# EAGLE design plc-6u-rs485-router (EAGLE 6.2)
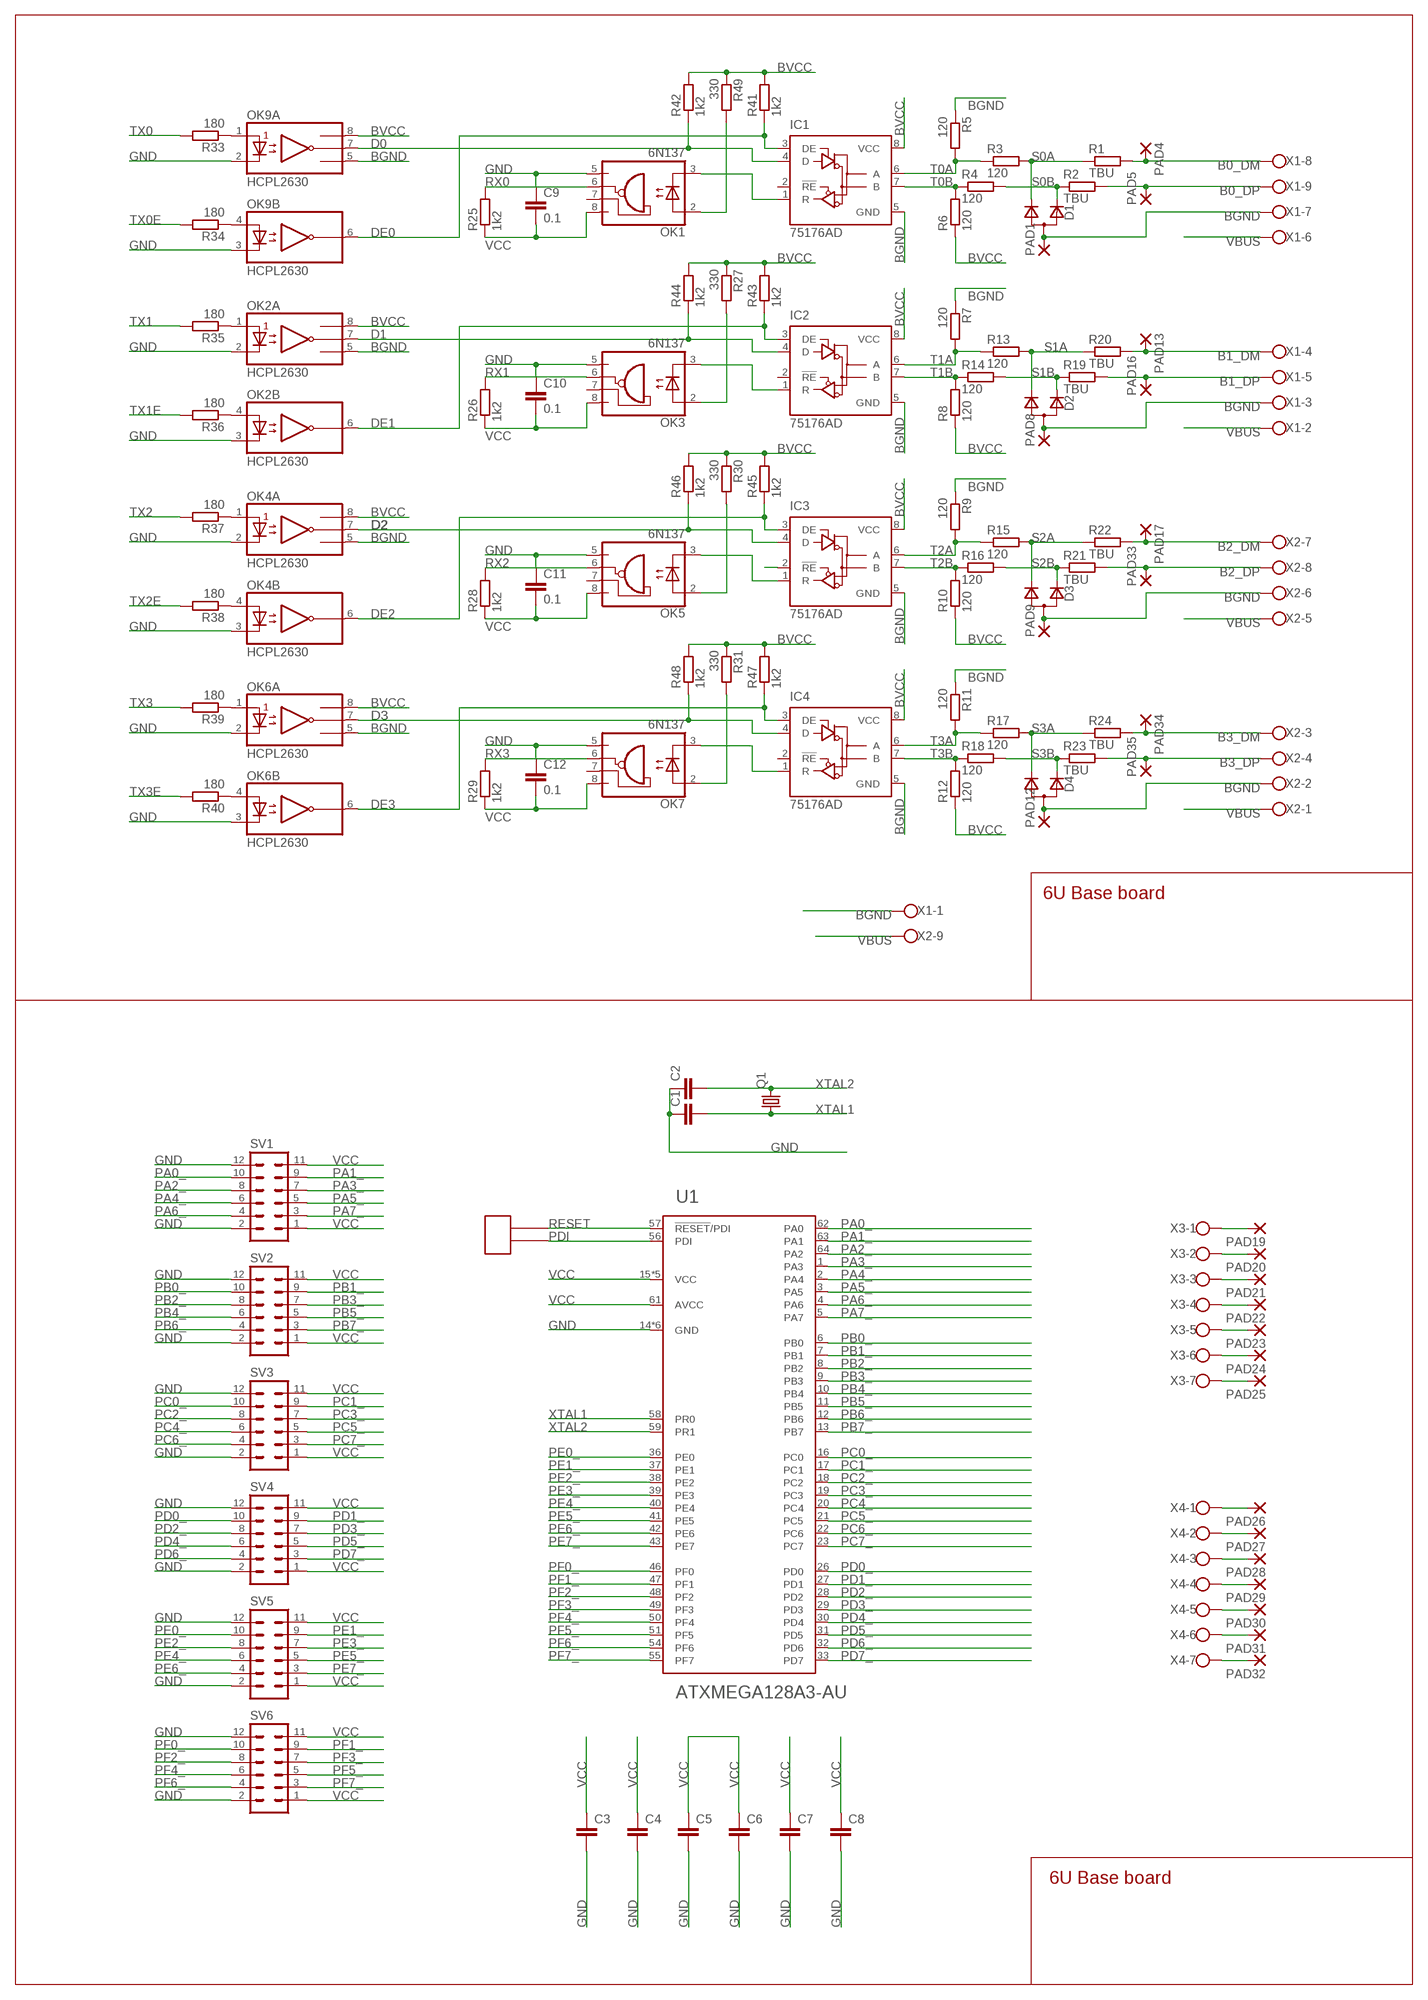
[diagram p0: schematic, sheet 1]

## Parts
C1  C-EUC0805  [C0805]
C2  C-EUC0805  [C0805]
C3  C-EUC0603  [C0603]
C4  C-EUC0603  [C0603]
C5  C-EUC0603  [C0603]
C6  C-EUC0603  [C0603]
C7  C-EUC0603  [C0603]
C8  C-EUC0603  [C0603]
C9  0.1  C-EUC0805  [C0805]
C10  0.1  C-EUC0805  [C0805]
C11  0.1  C-EUC0805  [C0805]
C12  0.1  C-EUC0805  [C0805]
D1  D_2CSOT323  [SOT323]
D2  D_2CSOT323  [SOT323]
D3  D_2CSOT323  [SOT323]
D4  D_2CSOT323  [SOT323]
IC1  75176AD  [D_R-PDSO-G8]
IC2  75176AD  [D_R-PDSO-G8]
IC3  75176AD  [D_R-PDSO-G8]
IC4  75176AD  [D_R-PDSO-G8]
OK1  6N137  [DIL08]
OK2  HCPL2630  [DIL08]
OK3  6N137  [DIL08]
OK4  HCPL2630  [DIL08]
OK5  6N137  [DIL08]
OK6  HCPL2630  [DIL08]
OK7  6N137  [DIL08]
OK9  HCPL2630  [DIL08]
PAD1  2,54/0,8  [2,54/0,8]
PAD4  2,54/0,8  [2,54/0,8]
PAD5  2,54/0,8  [2,54/0,8]
PAD8  2,54/0,8  [2,54/0,8]
PAD9  2,54/0,8  [2,54/0,8]
PAD12  2,54/0,8  [2,54/0,8]
PAD13  2,54/0,8  [2,54/0,8]
PAD16  2,54/0,8  [2,54/0,8]
PAD17  2,54/0,8  [2,54/0,8]
PAD19  2,54/0,8  [2,54/0,8]
PAD20  2,54/0,8  [2,54/0,8]
PAD21  2,54/0,8  [2,54/0,8]
PAD22  2,54/0,8  [2,54/0,8]
PAD23  2,54/0,8  [2,54/0,8]
PAD24  2,54/0,8  [2,54/0,8]
PAD25  2,54/0,8  [2,54/0,8]
PAD26  2,54/0,8  [2,54/0,8]
PAD27  2,54/0,8  [2,54/0,8]
PAD28  2,54/0,8  [2,54/0,8]
PAD29  2,54/0,8  [2,54/0,8]
PAD30  2,54/0,8  [2,54/0,8]
PAD31  2,54/0,8  [2,54/0,8]
PAD32  2,54/0,8  [2,54/0,8]
PAD33  2,54/0,8  [2,54/0,8]
PAD34  2,54/0,8  [2,54/0,8]
PAD35  2,54/0,8  [2,54/0,8]
Q1  CRYSTALHC49S  [HC49/S]
R1  TBU  R-EU_WSC2515  [WSC2515]
R2  TBU  R-EU_WSC2515  [WSC2515]
R3  120  R-EU_R0805  [R0805]
R4  120  R-EU_R0805  [R0805]
R5  120  R-EU_R0805  [R0805]
R6  120  R-EU_R0805  [R0805]
R7  120  R-EU_R0805  [R0805]
R8  120  R-EU_R0805  [R0805]
R9  120  R-EU_R0805  [R0805]
R10  120  R-EU_R0805  [R0805]
R11  120  R-EU_R0805  [R0805]
R12  120  R-EU_R0805  [R0805]
R13  120  R-EU_R0805  [R0805]
R14  120  R-EU_R0805  [R0805]
R15  120  R-EU_R0805  [R0805]
R16  120  R-EU_R0805  [R0805]
R17  120  R-EU_R0805  [R0805]
R18  120  R-EU_R0805  [R0805]
R19  TBU  R-EU_WSC2515  [WSC2515]
R20  TBU  R-EU_WSC2515  [WSC2515]
R21  TBU  R-EU_WSC2515  [WSC2515]
R22  TBU  R-EU_WSC2515  [WSC2515]
R23  TBU  R-EU_WSC2515  [WSC2515]
R24  TBU  R-EU_WSC2515  [WSC2515]
R25  1k2  R-EU_R0805  [R0805]
R26  1k2  R-EU_R0805  [R0805]
R27  330  R-EU_R0805  [R0805]
R28  1k2  R-EU_R0805  [R0805]
R29  1k2  R-EU_R0805  [R0805]
R30  330  R-EU_R0805  [R0805]
R31  330  R-EU_R0805  [R0805]
R33  180  R-EU_R0805  [R0805]
R34  180  R-EU_R0805  [R0805]
R35  180  R-EU_R0805  [R0805]
R36  180  R-EU_R0805  [R0805]
R37  180  R-EU_R0805  [R0805]
R38  180  R-EU_R0805  [R0805]
R39  180  R-EU_R0805  [R0805]
R40  180  R-EU_R0805  [R0805]
R41  1k2  R-EU_R0805  [R0805]
R42  1k2  R-EU_R0805  [R0805]
R43  1k2  R-EU_R0805  [R0805]
R44  1k2  R-EU_R0805  [R0805]
R45  1k2  R-EU_R0805  [R0805]
R46  1k2  R-EU_R0805  [R0805]
R47  1k2  R-EU_R0805  [R0805]
R48  1k2  R-EU_R0805  [R0805]
R49  330  R-EU_R0805  [R0805]
SV1  MA06-2  [MA06-2]
SV2  MA06-2  [MA06-2]
SV3  MA06-2  [MA06-2]
SV4  MA06-2  [MA06-2]
SV5  MA06-2  [MA06-2]
SV6  MA06-2  [MA06-2]
U1  ATXMEGA128A3-AU  [TQFP-64A-64]
U$1  MA02-1  [MA02-1]
X1  W237-09P  [W237-9P]
X2  W237-09P  [W237-9P]
X3  W237-07P  [W237-7P]
X4  W237-07P  [W237-7P]

## Nets
B0_DM: PAD4.1(P) R1.2 X1.8
B0_DP: PAD5.1(P) R2.2 X1.9
B1_DM: PAD16.1(P) R19.2 X1.5
B1_DP: PAD13.1(P) R20.2 X1.4
B2_DM: PAD17.1(P) R22.2 X2.7
B2_DP: PAD33.1(P) R21.2 X2.8
B3_DM: PAD34.1(P) R24.2 X2.3
B3_DP: PAD35.1(P) R23.2 X2.4
BGND: D1.1(A) D2.1(A) D3.1(A) D4.1(A) IC1.5(GND) IC2.5(GND) IC3.5(GND) IC4.5(GND) OK2.5(A:GND) OK4.5(A:GND) OK6.5(A:GND) OK9.5(A:GND) PAD1.1(P) PAD8.1(P) PAD9.1(P) PAD12.1(P) R5.1 R7.1 R9.1 R11.1 X1.1 X1.3 X1.7 X2.2 X2.6
BVCC: IC1.8(VCC) IC2.8(VCC) IC3.8(VCC) IC4.8(VCC) OK2.8(A:VCC) OK4.8(A:VCC) OK6.8(A:VCC) OK9.8(A:VCC) R6.1 R8.1 R10.1 R12.1 R27.1 R30.1 R31.1 R41.2 R42.2 R43.2 R44.2 R45.2 R46.2 R47.2 R48.2 R49.1
D0: IC1.4(D) OK9.7(A:VO1) R42.1
D1: IC2.4(D) OK2.7(A:VO1) R44.1
D2: IC3.4(D) OK4.7(A:VO1) R46.1
D3: IC4.4(D) OK6.7(A:VO1) R48.1
DE0: IC1.3(DE) OK9.6(B:VO2) R41.1
DE1: IC2.3(DE) OK2.6(B:VO2) R43.1
DE2: IC3.3(DE) OK4.6(B:VO2) R45.1
DE3: IC4.3(DE) OK6.6(B:VO2) R47.1
GND: C1.1 C2.1 C3.2 C4.2 C5.2 C6.2 C7.2 C8.2 C9.1 C10.1 C11.1 C12.1 OK1.5(GND) OK2.2(A:C1) OK2.3(B:C2) OK3.5(GND) OK4.2(A:C1) OK4.3(B:C2) OK5.5(GND) OK6.2(A:C1) OK6.3(B:C2) OK7.5(GND) OK9.2(A:C1) OK9.3(B:C2) SV1.2 SV1.12 SV2.2 SV2.12 SV3.2 SV3.12 SV4.2 SV4.12 SV5.2 SV5.12 SV6.2 SV6.12 U1.14(GND) U1.24(GND) U1.34(GND) U1.44(GND) U1.52(GND) U1.60(GND)
N$1: OK7.2(A) R31.2
N$2: OK5.2(A) R30.2
N$3: OK3.2(A) R27.2
N$4: OK1.2(A) R49.2
N$5: OK2.1(A:A1) R35.1
N$6: OK2.4(B:A2) R36.1
N$7: OK4.1(A:A1) R37.1
N$8: OK9.1(A:A1) R33.1
N$9: OK4.4(B:A2) R38.1
N$10: OK6.1(A:A1) R39.1
N$11: OK9.4(B:A2) R34.1
N$12: OK6.4(B:A2) R40.1
N$21: PAD19.1(P) X3.1
N$22: PAD20.1(P) X3.2
N$23: PAD21.1(P) X3.3
N$24: PAD22.1(P) X3.4
N$25: PAD23.1(P) X3.5
N$26: PAD24.1(P) X3.6
N$27: PAD25.1(P) X3.7
N$28: PAD26.1(P) X4.1
N$29: PAD27.1(P) X4.2
N$30: PAD28.1(P) X4.3
N$31: PAD29.1(P) X4.4
N$32: PAD30.1(P) X4.5
N$33: PAD31.1(P) X4.6
N$34: PAD32.1(P) X4.7
N$41: IC3.2(!RE)
PA0_: SV1.10 U1.62(PA0)
PA1_: SV1.9 U1.63(PA1)
PA2_: SV1.8 U1.64(PA2)
PA3_: SV1.7 U1.1(PA3)
PA4_: SV1.6 U1.2(PA4)
PA5_: SV1.5 U1.3(PA5)
PA6_: SV1.4 U1.4(PA6)
PA7_: SV1.3 U1.5(PA7)
PB0_: SV2.10 U1.6(PB0)
PB1_: SV2.9 U1.7(PB1)
PB2_: SV2.8 U1.8(PB2)
PB3_: SV2.7 U1.9(PB3)
PB4_: SV2.6 U1.10(PB4)
PB5_: SV2.5 U1.11(PB5)
PB6_: SV2.4 U1.12(PB6)
PB7_: SV2.3 U1.13(PB7)
PC0_: SV3.10 U1.16(PC0)
PC1_: SV3.9 U1.17(PC1)
PC2_: SV3.8 U1.18(PC2)
PC3_: SV3.7 U1.19(PC3)
PC4_: SV3.6 U1.20(PC4)
PC5_: SV3.5 U1.21(PC5)
PC6_: SV3.4 U1.22(PC6)
PC7_: SV3.3 U1.23(PC7)
PD0_: SV4.10 U1.26(PD0)
PD1_: SV4.9 U1.27(PD1)
PD2_: SV4.8 U1.28(PD2)
PD3_: SV4.7 U1.29(PD3)
PD4_: SV4.6 U1.30(PD4)
PD5_: SV4.5 U1.31(PD5)
PD6_: SV4.4 U1.32(PD6)
PD7_: SV4.3 U1.33(PD7)
PDI: U1.56(PDI) U$1.P1
PE0_: SV5.10 U1.36(PE0)
PE1_: SV5.9 U1.37(PE1)
PE2_: SV5.8 U1.38(PE2)
PE3_: SV5.7 U1.39(PE3)
PE4_: SV5.6 U1.40(PE4)
PE5_: SV5.5 U1.41(PE5)
PE6_: SV5.4 U1.42(PE6)
PE7_: SV5.3 U1.43(PE7)
PF0_: SV6.10 U1.46(PF0)
PF1_: SV6.9 U1.47(PF1)
PF2_: SV6.8 U1.48(PF2)
PF3_: SV6.7 U1.49(PF3)
PF4_: SV6.6 U1.50(PF4)
PF5_: SV6.5 U1.51(PF5)
PF6_: SV6.4 U1.54(PF6)
PF7_: SV6.3 U1.55(PF7)
R0: IC1.1(R) OK1.3(C)
R1: IC2.1(R) OK3.3(C)
R2: IC3.1(R) OK5.3(C)
R3: IC4.1(R) OK7.3(C)
RESET: U1.57(!RESET!/PDI) U$1.P2
RX0: OK1.6(VO) R25.2
RX1: OK3.6(VO) R26.2
RX2: OK5.6(VO) R28.2
RX3: OK7.6(VO) R29.2
S0A: D1.3(C2) R1.1 R3.2
S0B: D1.2(C1) R2.1 R4.2
S1A: D2.3(C2) R13.2 R20.1
S1B: D2.2(C1) R14.2 R19.1
S2A: D3.3(C2) R15.2 R22.1
S2B: D3.2(C1) R16.2 R21.1
S3A: D4.3(C2) R17.2 R24.1
S3B: D4.2(C1) R18.2 R23.1
T0A: IC1.6(A) R3.1 R5.2
T0B: IC1.7(B) R4.1 R6.2
T1A: IC2.6(A) R7.2 R13.1
T1B: IC2.7(B) R8.2 R14.1
T2A: IC3.6(A) R9.2 R15.1
T2B: IC3.7(B) R10.2 R16.1
T3A: IC4.6(A) R11.2 R17.1
T3B: IC4.7(B) R12.2 R18.1
TX0: R33.2
TX0E: R34.2
TX1: R35.2
TX1E: R36.2
TX2: R37.2
TX2E: R38.2
TX3: R39.2
TX3E: R40.2
VBUS: X1.2 X1.6 X2.1 X2.5 X2.9
VCC: C3.1 C4.1 C5.1 C6.1 C7.1 C8.1 C9.2 C10.2 C11.2 C12.2 OK1.8(VCC) OK3.8(VCC) OK5.8(VCC) OK7.8(VCC) R25.1 R26.1 R28.1 R29.1 SV1.1 SV1.11 SV2.1 SV2.11 SV3.1 SV3.11 SV4.1 SV4.11 SV5.1 SV5.11 SV6.1 SV6.11 U1.15(VCC) U1.25(VCC) U1.35(VCC) U1.45(VCC) U1.53(VCC) U1.61(AVCC)
XTAL1: C1.2 Q1.1 U1.58(PR0)
XTAL2: C2.2 Q1.2 U1.59(PR1)
Unconnected: IC1.2(!RE) IC2.2(!RE) IC4.2(!RE) OK1.7(VE) OK3.7(VE) OK5.7(VE) OK7.7(VE)

## Notes on the sheet
- 6U Base board
- 6U Base board

## Library data of the parts
C1-C12 = rcl:C-EU: CAPACITOR, European symbol
D1-D4 = zetex:D_2C: Dual DIODE; OC_FARNELL: unknown; OC_NEWARK: unknown
IC1-IC4 = 751xx:75176A: DIFFERENTIAL BUS TRANSCEIVER Source: http://focus.ti.com/lit/ds/symlink/sn75176a.pdf
OK1 OK3 OK5 OK7 = optocoupler:6N137: MOTOROLA OPTO COUPLER; MPN: 6N137; OC_FARNELL: 1328376; OC_NEWARK: 52M1895
OK2 OK4 OK6 OK9 = optocoupler:HCPL2630: HEWLETT PACKARD OPTO COUPLER; MF: AGILENT TECHNOLOGIES; MPN: HCPL-2630-000E; OC_FARNELL: 9994904; OC_NEWARK: 88H7813
PAD1 PAD4 PAD5 PAD8 PAD9 PAD12 PAD13 PAD16 PAD17 PAD19-PAD35 = wirepad:2,54/0,8: THROUGH-HOLE PAD
Q1 = crystal:CRYSTAL: CRYSTAL
R1-R31 R33-R49 = rcl:R-EU_: RESISTOR, European symbol
SV1-SV6 = con-lstb:MA06-2: PIN HEADER; OC_FARNELL: unknown; OC_NEWARK: unknown
U1 = atmel-xmega:ATXMEGA128A3: 8/16-bit XMEGA A3 Microcontroller Features High-performance, Low-power 8/16-bit Atmel® AVR® XMEGATM Microcontroller Non-volatile Program and Data Memories – 64 KB - 256 KB of In-System Self-Programmable Flash – 4 KB - 8 KB Boot Code Section with Independent Lock Bits – 2 KB - 4 KB EEPROM – 4 KB - 16 KB Internal SRAM Peripheral Features – Four-channel DMA Controller with support for external requests – Eight-channel Event System – Seven 16-bit Timer/Counters Four Timer/Counters with 4 Output Compare or Input Capture channels Three Timer/Counters with 2 Output Compare or Input Capture channels High Resolution Extensions on all Timer/Counters Advanced Waveform Extension on one Timer/Counter – Seven USARTs IrDA Extension on 1 USART – AES and DES Crypto Engine – Two Two-wire Interfaces with dual address match (I2C and SMBus compatible) – Three SPI (Serial Peripheral Interfaces) – 16-bit Real Time Counter with Separate Oscillator – Two Eight-channel, 12-bit, 2 Msps Analog to Digital Converters – One Two-channel, 12-bit, 1 Msps Digital to Analog Converter – Four Analog Comparators with Window compare function – External Interrupts on all General Purpose I/O pins – Programmable Watchdog Timer with Separate On-chip Ultra Low Power Oscillator Special Microcontroller Features – Power-on Reset and Programmable Brown-out Detection – Internal and External Clock Options with PLL – Programmable Multi-level Interrupt Controller – Sleep Modes: Idle, Power-down, Standby, Power-save, Extended Standby – Advanced Programming, Test and Debugging Interfaces JTAG (IEEE 1149.1 Compliant) Interface for test, debug and programming PDI (Program and Debug Interface) for programming, test and debugging I/O and Packages – 50 Programmable I/O Lines – 64-lead TQFP – 64-pad QFN Operating Voltage – 1.6 – 3.6V Speed performance – 0 – 12 MHz @ 1.6 – 3.6V – 0 – 32 MHz @ 2.7 – 3.6V
U$1 = my-con:MA02-1
X1 X2 = con-wago-508:W237-09P: WAGO SREW CLAMP
X3 X4 = con-wago-508:W237-07P: WAGO SREW CLAMP

## Board
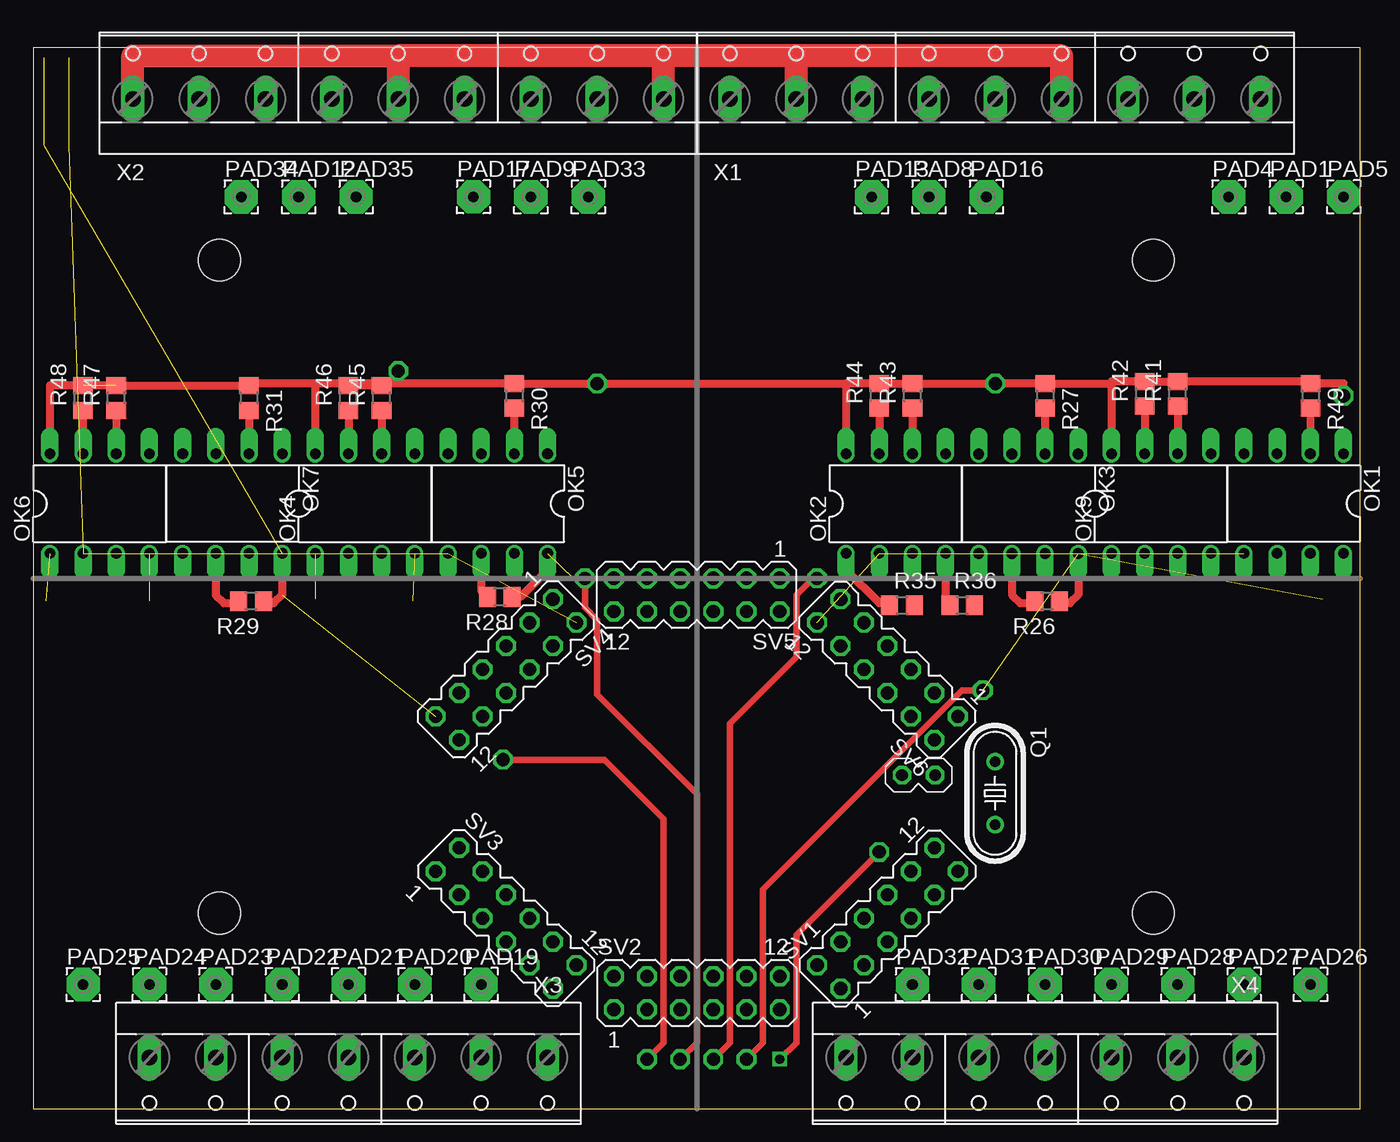
[diagram p1: board, top side]
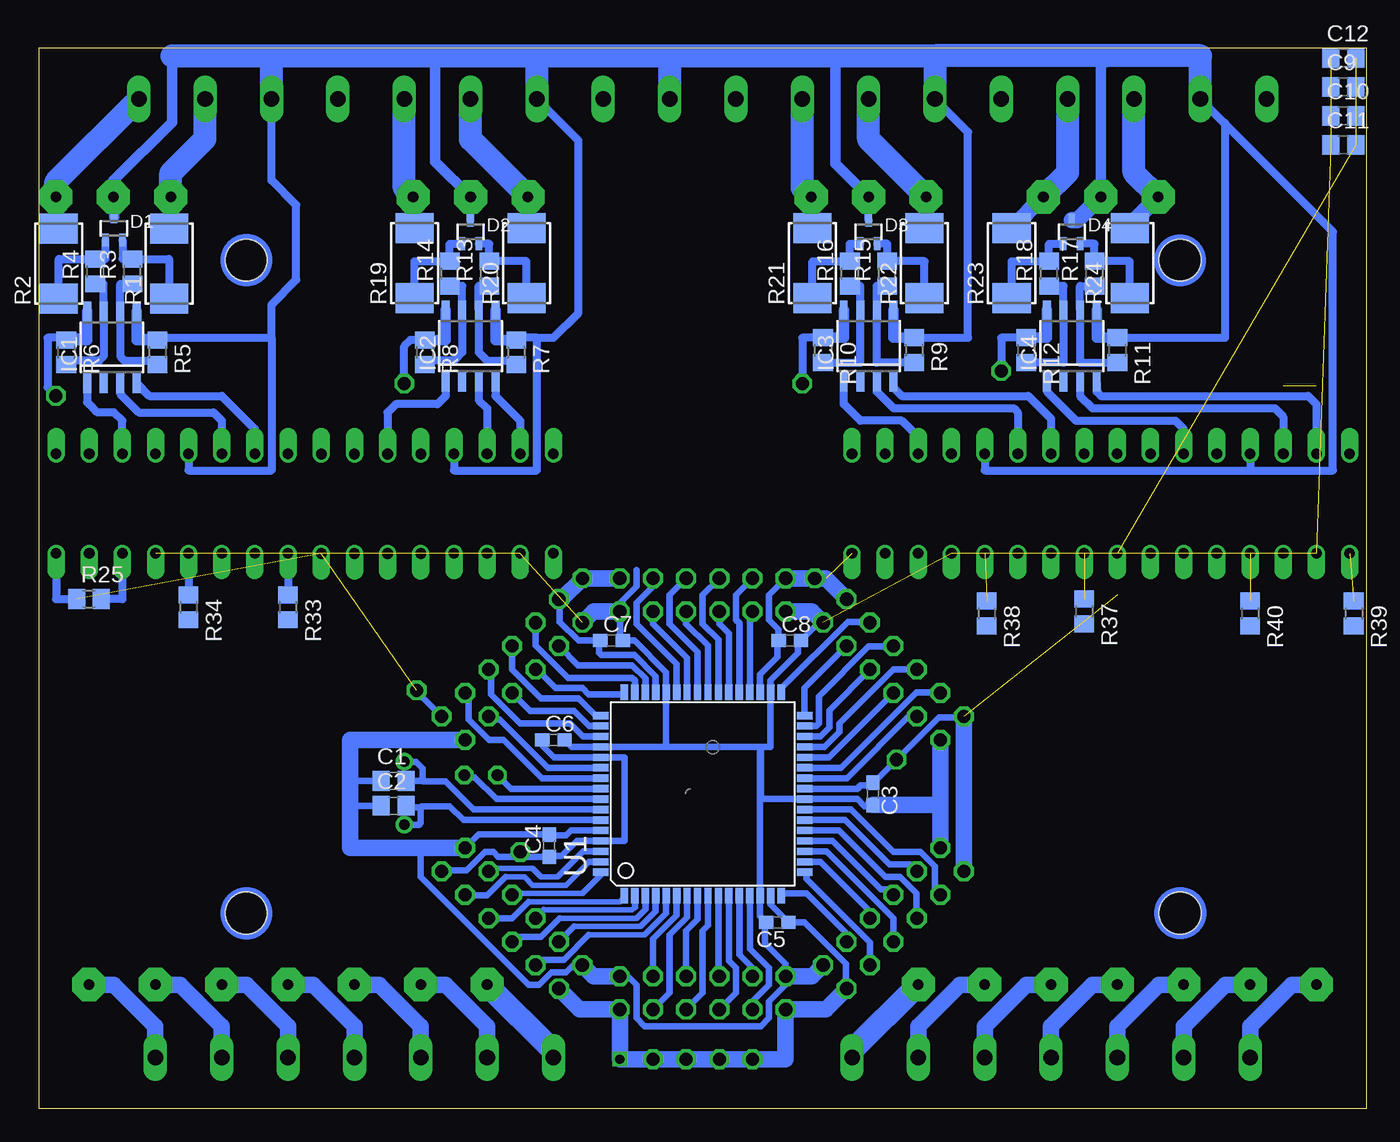
[diagram p2: board, bottom side, seen from below]

Size 101.6 x 81.28 mm. Coordinates in mm from the lower left corner, seen from the top.
Outline: 0,0.01 101.6,0 101.6,81.28 0,81.28 0,0.01
Copper layers (1*16): Top 0.035mm / dielectric 1.5mm / Bottom 0.035mm
Design rules: minimum track width 10mil, minimum drill 24mil, track to track 8mil, track to pad 8mil, pad to pad 8mil, via to via 8mil, smd to smd 8mil, copper to edge 40mil, drill to drill 8mil, minimum pad ring 10mil, minimum via ring 8mil, stop-mask expansion 4mil, vias tented up to drill 0mil, thermal gap 10mil
Holes 3.2 mm at 14.25,15 14.25,65 85.75,15 85.75,65
bRestrict: area 10.5,11.1 to 18.1,18.7; area 81.9,11.3 to 89.5,18.9; area 10.4,61.2 to 18,68.8; area 81.9,61.2 to 89.5,68.8

### Footprints (pad centres in the part's own frame; a part is rotated, then mirrored left to right if it is on the bottom)
C0805 = smd 1.3 x 1.5: 1 -0.95,0; 2 0.95,0
C0603 = smd 1.1 x 1: 1 -0.85,0; 2 0.85,0
SOT323 = smd 0.5 x 1: 1 0,0.9; 2 -0.65,-0.9; 3 0.65,-0.9
D_R-PDSO-G8 = smd 0.6 x 1.5: 1 -1.905,-2.75; 2 -0.635,-2.75; 3 0.635,-2.75; 4 1.905,-2.75; 5 1.905,2.75; 6 0.635,2.75; 7 -0.635,2.75; 8 -1.905,2.75
DIL08 = drill 0.813 offset: 1 -3.81,-3.81; 2 -1.27,-3.81; 3 1.27,-3.81; 4 3.81,-3.81; 5 3.81,3.81; 6 1.27,3.81; 7 -1.27,3.81; 8 -3.81,3.81
2,54/0,8 = drill 0.813 pad 2.54 octagon: 1 0,0
HC49/S = drill 0.813: 1 -2.413,0; 2 2.413,0
WSC2515 = smd 2.29 x 2.92: 1 -2.675,0; 2 2.675,0
R0805 = smd 1.3 x 1.5: 1 -0.95,0; 2 0.95,0
MA06-2 = drill 1.016 octagon: 1 -6.35,-1.27; 2 -6.35,1.27; 3 -3.81,-1.27; 4 -3.81,1.27; 5 -1.27,-1.27; 6 -1.27,1.27; 7 1.27,-1.27; 8 1.27,1.27; 9 3.81,-1.27; 10 3.81,1.27; 11 6.35,-1.27; 12 6.35,1.27
TQFP-64A-64 = smd 1.194 x 0.559: 1 -7.8,6; 2 -7.8,5.2; 3 -7.8,4.4; 4 -7.8,3.6; 5 -7.8,2.8; 6 -7.8,2; 7 -7.8,1.2; 8 -7.8,0.4; 9 -7.8,-0.4; 10 -7.8,-1.2; 11 -7.8,-2; 12 -7.8,-2.8; 13 -7.8,-3.6; 14 -7.8,-4.4; 15 -7.8,-5.2; 16 -7.8,-6; 33 7.8,-6; 34 7.8,-5.2; 35 7.8,-4.4; 36 7.8,-3.6; 37 7.8,-2.8; 38 7.8,-2; 39 7.8,-1.2; 40 7.8,-0.4; 41 7.8,0.4; 42 7.8,1.2; 43 7.8,2; 44 7.8,2.8; 45 7.8,3.6; 46 7.8,4.4; 47 7.8,5.2; 48 7.8,6 | smd 0.559 x 1.194: 17 -6,-7.8; 18 -5.2,-7.8; 19 -4.4,-7.8; 20 -3.6,-7.8; 21 -2.8,-7.8; 22 -2,-7.8; 23 -1.2,-7.8; 24 -0.4,-7.8; 25 0.4,-7.8; 26 1.2,-7.8; 27 2,-7.8; 28 2.8,-7.8; 29 3.6,-7.8; 30 4.4,-7.8; 31 5.2,-7.8; 32 6,-7.8; 49 6,7.8; 50 5.2,7.8; 51 4.4,7.8; 52 3.6,7.8; 53 2.8,7.8; 54 2,7.8; 55 1.2,7.8; 56 0.4,7.8; 57 -0.4,7.8; 58 -1.2,7.8; 59 -2,7.8; 60 -2.8,7.8; 61 -3.6,7.8; 62 -4.4,7.8; 63 -5.2,7.8; 64 -6,7.8
MA02-1 = drill 0.9 octagon: P1 -1.27,0; P2 1.27,0
W237-9P = drill 1.194 long: 1 -20.32,-0.635; 2 -15.24,-0.635; 3 -10.16,-0.635; 4 -5.08,-0.635; 5 0,-0.635; 6 5.08,-0.635; 7 10.16,-0.635; 8 15.24,-0.635; 9 20.32,-0.635
W237-7P = drill 1.194 long: 1 -15.24,-0.635; 2 -10.16,-0.635; 3 -5.08,-0.635; 4 0,-0.635; 5 5.08,-0.635; 6 10.16,-0.635; 7 15.24,-0.635

### Placement (x,y rotation side)
C1  74.47,25.12 0 bottom
C2  74.47,23.22 0 bottom
C3  37.79,24.13 270 bottom
C4  62.55,20.16 90 bottom
C5  45.09,14.29 180 bottom
C6  62.23,28.26 0 bottom
C7  57.79,35.88 0 bottom
C8  44.14,35.88 0 bottom
C9  1.75,78.26 0 bottom
C10  1.75,76.04 0 bottom
C11  1.75,73.82 0 bottom
C12  1.75,80.49 0 bottom
D1  95.88,67.42 0 bottom
D2  68.58,67.15 0 bottom
D3  38.1,67.15 0 bottom
D4  22.55,67.15 0 bottom
IC1  96.04,58.33 0 bottom
IC2  68.58,58.42 0 bottom
IC3  38.1,58.42 0 bottom
IC4  22.55,58.42 0 bottom
OK1  96.51,46.36 180 top
OK2  66.04,46.35 0 top
OK3  76.2,46.35 180 top
OK4  25.4,46.35 0 top
OK5  35.57,46.35 180 top
OK6  5.08,46.35 0 top
OK7  15.25,46.36 180 top
OK9  86.36,46.35 0 top
PAD1  95.93,69.85 0 top
PAD4  91.53,69.85 0 top
PAD5  100.33,69.85 0 top
PAD8  68.58,69.85 0 top
PAD9  38.1,69.85 0 top
PAD12  20.32,69.85 0 top
PAD13  64.18,69.85 0 top
PAD16  72.98,69.85 0 top
PAD17  33.7,69.85 0 top
PAD19  34.29,9.53 0 top
PAD20  29.21,9.53 0 top
PAD21  24.13,9.53 0 top
PAD22  19.05,9.53 0 top
PAD23  13.97,9.53 0 top
PAD24  8.89,9.53 0 top
PAD25  3.81,9.53 0 top
PAD26  97.79,9.53 0 top
PAD27  92.71,9.53 0 top
PAD28  87.63,9.53 0 top
PAD29  82.55,9.53 0 top
PAD30  77.47,9.52 0 top
PAD31  72.39,9.53 0 top
PAD32  67.31,9.53 0 top
PAD33  42.5,69.85 0 top
PAD34  15.92,69.85 0 top
PAD35  24.72,69.85 0 top
Q1  73.64,24.18 270 top
R1  91.66,64.73 90 bottom
R2  100.11,64.74 90 bottom
R3  94.46,64.14 90 bottom
R4  97.32,64.14 90 bottom
R5  92.55,57.94 270 bottom
R6  99.54,57.94 270 bottom
R7  65.09,57.94 270 bottom
R8  72.08,57.94 270 bottom
R9  34.61,58.1 270 bottom
R10  41.6,58.1 270 bottom
R11  19.05,58.1 270 bottom
R12  26.04,58.1 270 bottom
R13  67.15,63.98 90 bottom
R14  70.17,63.98 90 bottom
R15  36.67,63.98 90 bottom
R16  39.53,63.98 90 bottom
R17  20.8,63.98 90 bottom
R18  24.29,63.98 90 bottom
R19  72.87,64.77 90 bottom
R20  64.3,64.77 90 bottom
R21  42.39,64.77 90 bottom
R22  33.82,64.77 90 bottom
R23  27.15,64.77 90 bottom
R24  18.1,64.77 90 bottom
R25  97.79,39.05 0 bottom
R26  77.63,38.89 180 top
R27  77.47,54.61 270 top
R28  35.72,39.21 180 top
R29  16.67,38.89 180 top
R30  36.83,54.61 270 top
R31  16.51,54.45 270 top
R33  82.55,38.42 270 bottom
R34  90.17,38.42 270 bottom
R35  66.52,38.58 0 top
R36  71.12,38.58 0 top
R37  21.59,38.1 270 bottom
R38  29.05,37.94 270 bottom
R39  0.96,37.94 270 bottom
R40  8.89,37.94 270 bottom
R41  87.63,54.77 90 top
R42  85.09,54.77 90 top
R43  67.31,54.61 90 top
R44  64.77,54.61 90 top
R45  26.67,54.45 90 top
R46  24.13,54.45 90 top
R47  6.35,54.45 90 top
R48  3.81,54.45 90 top
R49  97.79,54.61 270 top
SV1  65.41,14.61 45 top
SV2  50.8,8.89 0 top
SV3  36.2,14.61 315 top
SV4  36.2,33.66 225 top
SV5  50.8,39.37 180 top
SV6  65.41,33.66 135 top
U1  50.8,24.13 90 bottom
U$1  67.79,25.56 0 top
X1  73.66,77.98 0 top
X2  27.94,77.98 0 top
X3  24.13,3.3 180 top
X4  77.47,3.3 180 top

### Tracks (layer width: path | path; a pad name or v marks a point on that pad's centre or on a via)
B0_DM
  Bottom 0.61: PAD4.1 91.66,69.85 R1.2
  Bottom 1.778: PAD4.1 91.53,71.67 88.9,74.3 X1.8
B0_DP
  Bottom 0.61: PAD5.1 100.33,66.83 100.11,66.83 R2.2
  Bottom 1.778: PAD5.1 100.33,70.99 X1.9
B1_DM
  Bottom 0.61: PAD16.1 72.87,69.85 R19.2
  Bottom 1.778: PAD16.1 73.66,70.53 X1.5
B1_DP
  Bottom 0.61: PAD13.1 64.3,69.85 R20.2
  Bottom 1.778: PAD13.1 68.58,74.25 X1.4
B2_DM
  Bottom 0.61: PAD17.1 33.82,69.85 R22.2
  Bottom 1.778: PAD17.1 38.1,74.25 X2.7
B2_DP
  Bottom 0.61: PAD33.1 42.39,69.85 R21.2
  Bottom 1.778: PAD33.1 43.18,70.53 X2.8
B3_DM
  Bottom 1.27: R24.2 18.1,67.67 PAD34.1
  Bottom 1.778: PAD34.1 17.78,71.71 X2.3
B3_DP
  Bottom 1.27: PAD35.1 24.74,69.85 R23.2
  Bottom 1.778: PAD35.1 22.86,71.71 X2.4
BGND
  Bottom 0.61: D3.1 PAD9.1 | D2.1 PAD8.1 | OK9.5 90.17,48.9 83.82,48.9 83.82,59.05 | 94.14,58.89 93.97,59.05 83.82,59.05 | OK2.5 69.85,48.9 63.5,48.9 63.5,59.05 | OK6.5 8.89,48.9 | 8.89,48.9 2.54,48.9 2.54,67.18 10.86,75.5 | R9.1 30.48,59.05 30.48,74.8 X2.6 | OK4.5 29.21,48.9 8.89,48.9 | 83.82,59.05 83.82,61.59 81.92,63.5 81.92,69.22 83.82,71.12 X1.7 | 63.5,59.05 62.23,59.05 60.33,60.96 60.33,74.17 X1.3 | 10.86,75.5 X2.2 | 63.5,59.05 64.93,59.05 R7.1 | IC4.5 20.64,59.05 10.8,59.05 10.8,75.5 10.86,75.5
  Bottom 0.813: 91.44,80.64 91.44,75.56 95.93,71.08 PAD1.1 95.88,69.8 D1.1 | PAD12.1 20.32,80.33 20.01,80.64 | PAD9.1 40.64,72.39 40.64,80.64 | PAD8.1 71.28,72.55 71.28,80.64 | R5.1 94.14,58.89 IC1.5 | R7.1 66.68,58.89 IC2.5 | R9.1 36.2,59.05 IC3.5 | R11.1 20.64,59.05 IC4.5
  Bottom 1.27: D4.1 22.12,68.05 PAD12.1
  Bottom 1.778: 33.02,80.64 20.01,80.64 12.7,80.64 X2.2 | 33.02,80.64 X2.6 | 53.34,80.64 40.64,80.64 33.02,80.64 | 53.34,80.64 X1.1 | X1.3 63.5,80.64 | 63.5,80.64 53.34,80.64 | 91.44,80.64 83.82,80.64 | 83.82,80.64 71.28,80.64 63.5,80.64 | X1.7 83.82,80.64
BVCC  (via drill 1)  (1 unrouted)
  Top 0.61: 82.55,55.56 OK9.8 | v100.33,54.61 100.33,55.56 R49.1 97.63,55.72 R41.2 R42.2 82.55,55.72 82.55,55.56 | OK6.8 1.27,55.4 R47.2 R31.1 16.51,55.56 21.59,55.56 | 27.94,55.56 R30.1 v43.18,55.56 62.23,55.56 | 27.94,55.56 26.67,55.56 | 26.67,55.56 21.59,55.56 | 21.59,55.56 OK4.8 | 26.67,55.56 R45.2 R46.2 | R44.2 62.23,55.56 | 62.23,55.56 OK2.8 | 82.55,55.56 R27.1 v73.67,55.56 v73.66,55.56 R44.2 | R44.2 R43.2 | v27.94,56.52 27.94,55.56
  Bottom 0.61: 97.95,58.89 98.11,59.05 100.97,59.05 100.97,55.24 v100.33,54.61 | 70.49,58.89 73.19,58.89 73.66,58.42 v73.66,55.56 | 40.01,59.05 43.18,59.05 v43.18,55.56 | R12.1 27.94,59.05 v27.94,56.52
  Bottom 0.813: R6.1 97.95,58.89 IC1.8 | R8.1 70.49,58.89 IC2.8 | R10.1 40.01,59.05 IC3.8 | R12.1 24.45,59.05 IC4.8
D0
  Top 0.61: R42.1 OK9.7
  Bottom 0.61: IC1.4 93.17,54.61 87.63,54.61 85.09,52.07 OK9.7
D1
  Top 0.61: R44.1 OK2.7
  Bottom 0.61: IC2.4 66.68,54.61 64.77,52.7 OK2.7
D2
  Top 0.61: R46.1 OK4.7
  Bottom 0.61: IC3.4 36.2,55.24 35.56,54.61 25.88,54.61 24.13,52.87 OK4.7
D3
  Top 0.61: OK6.7 R48.1
  Bottom 0.61: IC4.4 20.64,54.93 20.32,54.61 4.45,54.61 3.81,53.98 OK6.7
DE0
  Top 0.61: R41.1 OK9.6
  Bottom 0.61: IC1.3 95.41,54.76 93.98,53.34 88.27,53.34 87.63,52.7 OK9.6
DE1
  Top 0.61: R43.1 OK2.6
  Bottom 0.61: IC2.3 67.95,54.3 R43.1 OK2.6
DE2
  Top 0.61: R45.1 OK4.6
  Bottom 0.61: IC3.3 37.47,54.93 36.2,53.66 26.99,53.66 26.67,53.34 OK4.6
DE3
  Top 0.61: R47.1 OK6.6
  Bottom 0.61: IC4.3 21.91,54.61 20.96,53.66 6.99,53.66 6.35,53.02 OK6.6
GND  (16 unrouted)
  Bottom 0.508: C3.2 37.89,23.18 38.42,23.18 38.97,23.73 U1.24 46.36,23.73 46.36,27.73 | 53.6,27.73 U1.52 60.86,27.73 C6.2 | 53.6,27.73 U1.44 53.6,33.44 56.04,35.88 C7.2 57.15,36.09 SV5.2 57.15,38.73 55.88,40.01 55.88,41.27 | U1.60 60.91,21.33 61.28,20.95 62.49,20.95 C4.2 67.98,21.01 SV1.12 69.01,20 | 32.82,23.28 32.61,23.5 | SV4.2 41.92,37.25 C8.2 43.5,35.66 43.5,34.92 45.6,32.82 U1.34 45.6,27.73 46.36,27.73 | 69.01,28.26 SV6.2 | SV2.12 56.52,10.16 55.88,9.53 55.88,6.99 55.25,6.35 46.36,6.35 45.72,6.99 45.72,8.26 44.45,9.53 SV2.2 44.45,11.11 46.04,12.7 46.04,14.19 C5.2 46.4,14.75 U1.14 46.4,27.73 | C1.1 77.51,25.12 77.79,25.4 | C2.1 77.75,23.22 77.79,23.18 | SV1.2 60.75,11.01 61.28,10.48 62.39,10.48 63.34,9.53 64.14,9.53 72.39,17.78 72.39,20 | 46.4,27.73 53.6,27.73 | 46.4,27.73 46.36,27.73
  Bottom 0.61: C2.1
  Bottom 1.27: SV4.12 32.61,23.5 SV3.2 | C3.2 32.82,23.28 | SV3.12 42.44,10.16 SV2.2 | SV5.12 42.44,38.1 SV4.2 | SV6.12 59.17,38.1 SV5.2 | 69.01,28.26 77.79,28.26 77.79,25.4 77.79,23.18 77.79,20 72.39,20 69.01,20 | SV2.12 59.17,10.16 SV1.2
N$1
  Top 0.61: R31.2 OK7.2
N$2
  Top 0.61: R30.2 OK5.2
N$3
  Top 0.61: R27.2 OK3.2
N$4
  Top 0.61: R49.2 97.78,53.65 OK1.2
N$5
  Top 0.61: OK2.1 62.23,41.27 64.77,38.73 65.41,38.73 R35.1
N$6
  Top 0.61: OK2.4 69.85,38.9 R36.1
N$7  (1 unrouted)
N$8
  Bottom 0.61: OK9.1 R33.1
N$9  (1 unrouted)
N$10  (1 unrouted)
N$11
  Bottom 0.61: OK9.4 R34.1
N$12  (1 unrouted)
N$21
  Bottom 1.778: X3.1 39.37,4.45 PAD19.1
N$22
  Bottom 1.27: PAD20.1 31.12,9.53 34.29,6.35 X3.2
N$23
  Bottom 1.27: PAD21.1 26.04,9.53 29.21,6.35 X3.3
N$24
  Bottom 1.27: PAD22.1 20.96,9.53 24.13,6.35 X3.4
N$25
  Bottom 1.27: PAD23.1 15.88,9.53 19.05,6.35 X3.5
N$26
  Bottom 1.27: PAD24.1 10.8,9.53 13.97,6.35 X3.6
N$27
  Bottom 1.27: PAD25.1 5.72,9.53 8.89,6.35 X3.7
N$28
  Bottom 1.27: PAD26.1 95.89,9.53 92.71,6.35 X4.1
N$29
  Bottom 1.27: PAD27.1 90.81,9.53 87.63,6.35 X4.2
N$30
  Bottom 1.27: PAD28.1 85.73,9.53 82.55,6.35 X4.3
N$31
  Bottom 1.27: PAD29.1 80.65,9.53 77.47,6.35 X4.4
N$32
  Bottom 1.27: PAD30.1 75.57,9.53 72.39,6.35 X4.5
N$33
  Bottom 1.27: PAD31.1 70.49,9.53 67.31,6.35 X4.6
N$34
  Bottom 1.778: X4.7 62.23,4.45 PAD32.1
PA0_
  Bottom 0.406: 66.99,18.41 63.82,18.41 63.19,17.78 61.92,17.78 59.97,19.73
  Bottom 0.508: SV1.10 66.99,18.41 | 59.97,19.73 U1.62
PA1_
  Bottom 0.406: 65.88,17.78 64.46,17.78 63.82,17.14 61.28,17.14 59.5,18.93
  Bottom 0.508: SV1.9 68.95,16.35 67.31,16.35 65.88,17.78 | 59.5,18.93 U1.63
PA2_
  Bottom 0.406: 65.3,16.51 60.01,16.51 58.6,17.92
  Bottom 0.508: SV1.8 65.3,16.51 | 58.6,17.92 U1.64
PA3_
  Bottom 0.406: 64.14,15.88 57.15,15.88 56.8,16.23
  Bottom 0.508: SV1.7 65.41,14.61 64.14,15.88 | 56.8,16.23 U1.1
PA4_
  Bottom 0.406: 56,15.44 56.2,15.24 62.98,15.24
  Bottom 0.508: U1.2 56,15.44 | 62.98,15.24 SV1.6
PA5_
  Bottom 0.406: 55.2,15.29 55.88,14.61 61.76,14.61
  Bottom 0.508: U1.3 55.2,15.29 | 61.76,14.61 63.19,13.18 65.04,13.18 SV1.5
PA6_
  Bottom 0.406: 54.4,15.13 55.57,13.97 60.66,13.97
  Bottom 0.508: U1.4 54.4,15.13 | 60.66,13.97 SV1.4
PA7_
  Bottom 0.406: 53.6,14.98 55.25,13.34 59.53,13.34
  Bottom 0.508: U1.5 53.6,14.98 | 59.53,13.34 61.44,11.43 63.2,11.43 SV1.3
PB0_
  Bottom 0.406: 52.8,14.83 54.61,13.02
  Bottom 0.508: U1.6 52.8,14.83 | 54.61,13.02 SV2.10
PB1_
  Bottom 0.406: 52,14.68 53.34,13.34
  Bottom 0.508: U1.7 52,14.68 | 53.34,13.34 53.34,8.89 SV2.9
PB2_
  Bottom 0.406: 51.2,14.52 52.07,13.65
  Bottom 0.508: U1.8 51.2,14.52 | 52.07,13.65 SV2.8
PB3_
  Bottom 0.508: U1.9 50.4,14.05 50.8,13.65 50.8,8.89 SV2.7
PB4_
  Bottom 0.508: U1.10 49.6,10.23 SV2.6
PB5_
  Bottom 0.508: U1.11 48.8,11.34 48.26,10.79 48.26,8.89 SV2.5
PB6_
  Bottom 0.508: U1.12 48,11.8 46.99,10.79 SV2.4
PB7_
  Bottom 0.508: U1.13 47.2,12.28 45.72,10.79 45.72,9.53 46.99,8.26 SV2.3
PC0_
  Bottom 0.508: SV3.10 39.79,13.44 42.87,16.51 44.62,16.51 U1.16
PC1_
  Bottom 0.508: SV3.9 37.99,12.75 42.87,17.62 42.87,17.99 U1.17
PC2_
  Bottom 0.508: U1.18 41.79,18.93 38.1,15.24 38.1,14.71 SV3.8
PC3_
  Bottom 0.508: U1.19 41.32,19.73 36.2,14.61 SV3.7
PC4_
  Bottom 0.508: U1.20 40.85,20.53 37.15,16.83 36.62,16.83 SV3.6
PC5_
  Bottom 0.508: SV3.5 34.45,14.65 34.45,16.51 35.72,17.78 36.83,17.78 40.38,21.33 U1.21
PC6_
  Bottom 0.508: U1.22 39.91,22.13 36.52,18.73 34.94,18.73 SV3.4
PC7_
  Bottom 0.508: SV3.3 33.02,16.82 33.02,18.57 34.13,19.68 36.2,19.68 39.44,22.93 U1.23
PD0_
  Bottom 0.508: U1.26 39.76,25.33 34.93,30.16 34.5,30.16 SV4.10
PD1_
  Bottom 0.508: U1.27 40.23,26.13 34.45,31.91 32.66,31.91 SV4.9
PD2_
  Bottom 0.508: U1.28 41.13,26.93 SV4.8
PD3_
  Bottom 0.508: U1.29 41.49,27.73 40.33,28.89 40.33,29.53 36.2,33.66 SV4.7
PD4_
  Bottom 0.508: U1.30 41.8,28.53 41.12,29.21 41.12,30.53 SV4.6
PD5_
  Bottom 0.508: U1.31 42.11,29.33 41.91,29.53 41.91,31.59 38.1,35.4 36.25,35.4 SV4.5
PD6_
  Bottom 0.508: U1.32 43,32.24 SV4.4
PD7_
  Bottom 0.508: U1.33 44.8,32.19 39.69,37.31 38.05,37.31 SV4.3
PDI
  Bottom 0.508: U1.56 65.49,24.53 U$1.P1
PE0_
  Bottom 0.508: U1.36 47.2,37.89 SV5.10
PE1_
  Bottom 0.508: U1.37 48,37.2 48.26,37.47 48.26,39.37 SV5.9
PE2_
  Bottom 0.508: U1.38 48.8,36.42 49.53,37.15 SV5.8
PE3_
  Bottom 0.508: U1.39 49.6,35.95 50.8,37.15 50.8,39.37 SV5.7
PE4_
  Bottom 0.508: U1.40 50.4,35.48 52.07,37.15 SV5.6
PE5_
  Bottom 0.508: U1.41 51.2,35.01 53.34,37.15 53.34,39.37 SV5.5
PE6_
  Bottom 0.508: U1.42 52,34.54 54.61,37.15 SV5.4
PE7_
  Bottom 0.508: U1.43 52.8,34.07 55.88,37.15 55.88,38.73 54.61,40.01 SV5.3
PF0_
  Bottom 0.508: U1.46 55.2,32.98 56.2,33.97 60.34,33.97 SV6.10
PF1_
  Bottom 0.508: U1.47 56,32.82 56.2,33.02 61.12,33.02 63.61,35.51 SV6.9
PF2_
  Bottom 0.508: SV6.8 63.5,33.66 62.07,32.23 60.01,32.23 59.53,31.75 56.98,31.75 U1.48
PF3_
  Bottom 0.508: SV6.7 65.41,33.66 63.19,31.43 60.33,31.43 59.03,30.13 U1.49
PF4_
  Bottom 0.508: U1.50 59.5,29.33 60.65,30.48 64.03,30.48 SV6.6
PF5_
  Bottom 0.508: SV6.5 67,33.45 67,31.75 64.77,29.53 60.96,29.53 59.97,28.53 U1.51
PF6_
  Bottom 0.508: U1.54 62.65,26.13 66.36,29.84 66.99,29.84 SV6.4
PF7_
  Bottom 0.508: U1.55 63.12,25.33 66.04,28.26 67.15,28.26 68.74,29.84 68.74,31.6 SV6.3
R0
  Bottom 0.61: OK1.3 95.25,52.7 95.89,53.34 97.16,53.34 97.48,53.66 97.79,53.98 97.95,54.13 IC1.1
R1
  Bottom 0.61: IC2.1 70.49,54.61 71.12,53.98 74.3,53.98 74.93,53.34 OK3.3
R2
  Bottom 0.61: OK5.3 34.3,51.44 35.56,52.7 38.74,52.7 40.01,53.98 IC3.1
R3
  Bottom 0.61: IC4.1 24.45,54.93 22.23,52.7 14.61,52.7 13.97,52.07 OK7.3
RESET
  Bottom 0.508: U1.57 66.6,23.73 68.27,25.4 68.9,25.4 U$1.P2
RX0
  Bottom 0.61: OK1.6 95.24,39.05 R25.2
RX1
  Top 0.61: OK3.6 74.93,39.37 75.57,38.73 76.52,38.73 R26.2
RX2
  Top 0.61: OK5.6 34.3,39.68 R28.2
RX3
  Top 0.61: OK7.6 13.98,39.36 14.61,38.73 15.56,38.73 R29.2
S0A
  Bottom 0.61: D1.3 95.23,65.08 R3.2 91.66,65.08 R1.1
  Bottom 0.813: 92.31,62.72 R1.1
S0B
  Bottom 0.61: D1.2 96.53,65.08 R4.2 100.11,65.08 R2.1
S1A
  Bottom 0.61: R20.1 64.3,64.93 R13.2 67.15,66.25 D2.3
S1B
  Bottom 0.61: D2.2 70.17,66.25 R14.2 72.87,64.93 R19.1
S2A
  Bottom 0.61: R22.1 33.82,64.93 R15.2 36.67,66.25 D3.3
S2B
  Bottom 0.61: D3.2 39.53,66.25 R16.2 42.39,64.93 R21.1
S3A
  Bottom 0.61: D4.3 20.8,66.25 R17.2 18.1,64.93 R24.1
S3B
  Bottom 0.61: D4.2 24.29,66.25 R18.2 27.15,64.93 R23.1
T0A
  Bottom 0.61: R3.1 95.41,63.19 IC1.6 95.41,57.62 95.09,57.31 92.87,57.31 R5.2
T0B
  Bottom 0.61: R4.1 96.68,63.19 IC1.7 96.68,57.63 97,57.31 99.22,57.31 R6.2
T1A
  Bottom 0.61: R13.1 67.95,63.03 IC2.6 67.95,57.94 67.31,57.31 65.41,57.31 R7.2
T1B
  Bottom 0.61: R14.1 69.22,63.03 IC2.7 69.22,57.94 69.85,57.31 71.76,57.31 R8.2
T2A
  Bottom 0.61: R15.1 37.47,63.03 IC3.6 37.47,57.15 R9.2
T2B
  Bottom 0.61: R16.1 38.74,63.03 38.74,61.75 IC3.7 38.74,57.15 R10.2
T3A
  Bottom 0.61: R17.1 21.91,63.03 IC4.6 21.91,57.15 R11.2
T3B
  Bottom 0.61: R18.1 23.18,63.03 IC4.7 23.18,57.15 R12.2
VBUS
  Top 1.778: X2.1 7.62,80.64 27.94,80.64 | 27.94,80.64 X2.5 | X2.9 48.26,80.64 | 48.26,80.64 27.94,80.64 | X1.2 58.42,80.64 | 58.42,80.64 48.26,80.64 | X1.6 78.74,80.64 58.42,80.64
VCC  (via drill 0.7, 1)  (8 unrouted)
  Top 0.508: v60.01,40.64 59.69,40.64 58.42,39.37 58.42,34.61 53.34,29.53 53.34,5.08 v52.07,3.81 | v42.23,40.64 42.23,38.42 43.18,37.47 43.18,31.75 50.8,24.13 50.8,5.08 v49.53,3.81 | v35.96,26.75 43.74,26.75 48.26,22.23 48.26,5.08 v46.99,3.81 | v72.71,32.07 71.12,32.07 55.88,16.83 55.88,5.08 v54.61,3.81 | v64.77,19.68 58.42,13.34 58.42,5.08 v57.15,3.81
  Top 0.61: OK7.8 19.06,39.38 18.42,38.73 17.78,38.73 R29.1 | R28.1 37.31,39.21 39.37,41.27 OK5.8 | OK3.8 80.01,39.37 79.38,38.73 78.74,38.73 R26.1
  Bottom 0.508: U1.15 45.6,15.65 C5.1 43.02,14.29 39.85,11.11 39.85,9.28 SV3.11 | U1.25 38.97,24.53 38.74,24.77 38,24.77 C3.1 37.73,24.98 v35.96,26.75 32.71,30 30.87,30 SV4.11 | C6.1 63.03,28.2 63.03,27.78 62.18,26.93 U1.53 56.78,26.93 56.78,20.53 U1.61 60.44,20.53 61.6,19.37 62.49,19.37 C4.1 64.4,19.31 | U1.45 54.4,33.13 56.04,34.77 58.58,34.77 58.74,34.92 58.74,35.77 C7.1 60.33,35.88 61.76,37.31 61.76,38.98 SV6.11 | U1.35 46.4,33.29 45.09,34.61 45.09,35.77 C8.1 44.99,36.73 45.72,37.47 45.72,39.37 SV5.11 | 64.4,19.31 66.46,19.31 66.84,19.68 67.47,19.68 68.9,18.26 70.74,18.26 SV1.11 71.01,18.41 | v60.01,40.64 60.22,40.64 SV6.11 | 61.61,39.04 SV6.11 | SV6.1 72.71,31.98 v72.71,32.07 | 64.4,19.31 v64.77,19.68
  Bottom 0.61: OK1.8 100.32,39.05 R25.1
  Bottom 1.27: SV3.1 SV4.11 | SV3.11 41.39,7.62 SV2.1 44.45,3.81 v46.99,3.81 v49.53,3.81 v52.07,3.81 v54.61,3.81 v57.15,3.81 SV2.11 60.22,7.62 SV1.1 | SV4.1 41.39,40.64 v42.23,40.64 SV5.11 | SV5.1 v60.01,40.64 61.61,39.04
XTAL1
  Bottom 0.508: Q1.1 72.77,26.59 72.25,26.07 72.25,25.12 | C1.2 72.25,25.12 | U1.58 68.34,22.93 70.49,25.08 72.21,25.08 72.25,25.12
  Bottom 0.61: 73.64,25.25 C1.2
XTAL2
  Bottom 0.508: 73.64,23.09 72.44,23.09 | U1.59 69.12,22.13 70.17,23.18 72.35,23.18 72.44,23.09 | Q1.2 72.53,21.77 72.39,21.91 72.39,23.05 72.44,23.09
  Bottom 0.61: 73.64,23.09 C2.2
(copper drawn outside any net)
  shapes: Bottom circle x4